# Altium schematic sheet Sheet1.SchDoc
size A4; SheetNumber: 1; SheetTotal: 1
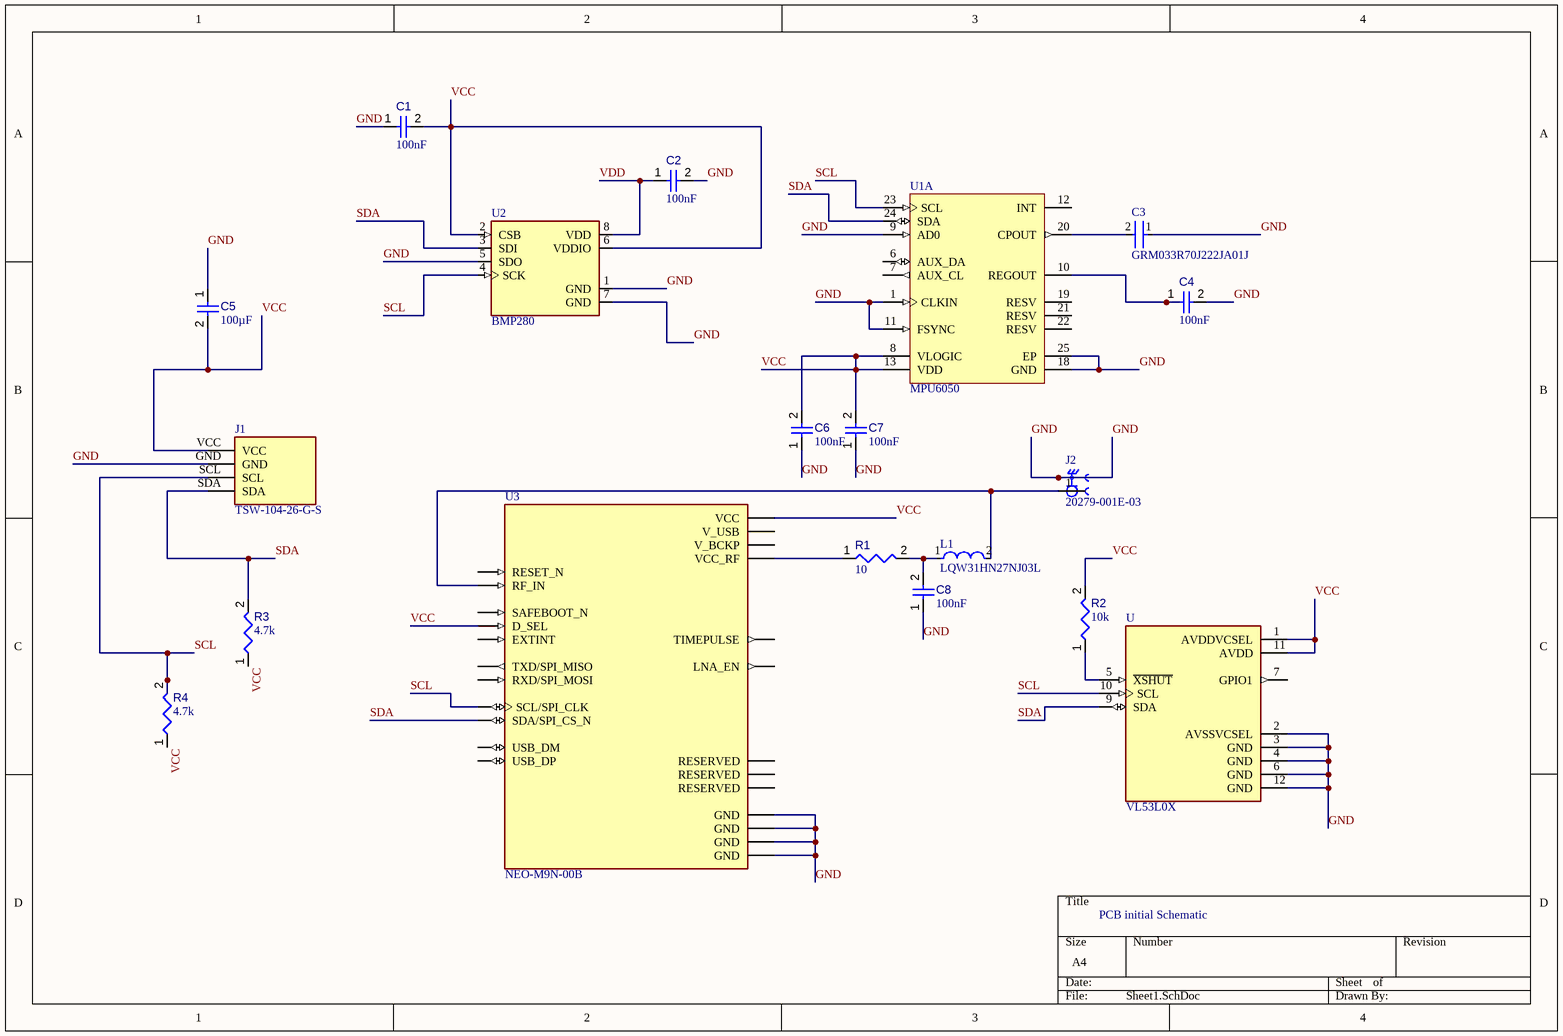
[diagram p0: Sheet1.SchDoc]

## Parts
C1  value 100nF  [CAPC0402(1005)60_L]  (hidden comment: Capacitor 100nF +/-20% 10V 0402)
C2  value 100nF  [CAPC0402(1005)60_L]  (hidden comment: Capacitor 100nF +/-20% 10V 0402)
C3  GRM033R70J222JA01J  [FP-GRM033-0_03-IPC_B]
C4  value 100nF  [CAPC1005X56X25LL10T15]  (hidden comment: Capacitor 0.1 uF +/- 5% 16 V 0402)
C5  value 100µF  [CAPC0805(2012)145_L]  (hidden comment: Capacitor 100µF +/-20% 6.3V 0805)
C6  value 100nF  [CAPC0402(1005)60_L]  (hidden comment: Capacitor 100nF +/-20% 10V 0402)
C7  value 100nF  [CAPC0402(1005)60_L]  (hidden comment: Capacitor 100nF +/-20% 10V 0402)
C8  value 100nF  [CAPC1608X90X40NL10T20]  (hidden comment: Capacitor 100 nF +/-10% 50 V 0603)
J1  TSW-104-26-G-S  [SAMTEC_TSW-104-26-G-S]
J2  20279-001E-03  [IPEX_20279-001E-03]
L1  LQW31HN27NJ03L  [FP-LQW31HN_03-MFG]
R1  value 10  [RESC0402(1005)_L]  (hidden comment: Resistor 10R  +/-1 % 0402 63 mW)
R2  value 10k  [RESC1005X40X25ML05T05]  (hidden comment: Resistor 10k +/-1% 0402 100 mW)
R3  value 4.7k  [RESC1005X40X25ML05T05]  (hidden comment: Resistor 4k7 +/-1% 0402 100 mW)
R4  value 4.7k  [RESC1005X40X25ML05T05]  (hidden comment: Resistor 4k7 +/-1% 0402 100 mW)
U  VL53L0X  [SENSOR_VL53L0X]
U1  MPU6050  [INSE-QFN-24_V]  (part A of 2)
U2  BMP280  [XDCR_BMP280]
U3  NEO-M9N-00B  [XCVR_NEO-M9N-00B]

## Nets
GND: C1.1 C2.2 C3.1 C4.2 C5.1 C6.1 C7.1 C8.1 J1.GND J2.2(GROUND) J2.3(GROUND) U.2(AVSSVCSEL) U.3(GND) U.4(GND) U.6(GND) U.12(GND) U1.1(CLKIN) U1.9(AD0) U1.11(FSYNC) U1.18(GND) U1.25(EP) U2.1(GND) U2.5(SDO) U2.7(GND) U3.10(GND) U3.12(GND) U3.13(GND) U3.24(GND)
SCL: J1.SCL R4.2 U.10(SCL) U1.23(SCL) U2.4(SCK) U3.19(SCL/SPI_CLK)
SDA: J1.SDA R3.2 U.9(SDA) U1.24(SDA) U2.3(SDI) U3.18(SDA/SPI_CS_N)
VCC: C1.2 C5.2 C6.2 C7.2 J1.VCC R2.2 R3.1 R4.1 U.1(AVDDVCSEL) U.11(AVDD) U1.8(VLOGIC) U1.13(VDD) U2.2(CSB) U2.6(VDDIO) U3.2(D_SEL) U3.23(VCC)
VDD: C2.1 U2.8(VDD)
NetC3_2: C3.2 U1.20(CPOUT)
NetC4_1: C4.1 U1.10(REGOUT)
NetC8_2: C8.2 L1.1 R1.2
NetJ2_1: J2.1(SIGNAL) L1.2 U3.11(RF_IN)
NetR1_1: R1.1 U3.9(VCC_RF)
NetR2_1: R2.1 U.5(~{XSHUT})

Not connected (* = marked no-connect by the designer): U 7(GPIO1); U1 6(AUX_DA) 7(AUX_CL) 12(INT) 19(RESV) 21(RESV) 22(RESV); U3 1(SAFEBOOT_N) 3(TIMEPULSE) 4(EXTINT) 5(USB_DM) 6(USB_DP) 7(V_USB) 8(RESET_N) 14(LNA_EN) 15(RESERVED) 16(RESERVED) 17(RESERVED) 20(TXD/SPI_MISO) 21(RXD/SPI_MOSI) 22(V_BCKP)

## Notes on the sheet
- PCB initial Schematic

## Library data of the parts
C1 C2 C6 C7 = CMP-001-00061-3: Chip Capacitor, 100nF +/-20%, 10V, 0402, Thickness 0.6 mm; Tolerance: 20%; Mounting Technology: SMT; Voltage Rating: 10V; Max Operating Temperature: 85°C; Pins: 2; Case/Package: 0402; Min Operating Temperature: -55°C
C3 = CMP-06035-025705-1: Chip Multilayer Ceramic Capacitors for General Purpose, 0201, 2200pF, X7R, 15%, 5%, 6.3V; Capacitance: 2.2nF; Voltage Rating (DC): 6.3V; Dielectric: X7R; Tolerance: 5%; Width: 300um; Thickness: 300um; Length: 600um
C4 = CMP-001-00001-6: Chip Capacitor, 0.1 uF, +/- 5%, 16 V, 0402 (1005 Metric); Capacitor Type: Ceramic; Voltage Rating: 16V; Max Operating Temperature: 125°C; Min Operating Temperature: -55°C; Case/Package: 0402; Mounting Technology: SM; Pins: 2; Tolerance: 5%; RoHS Compliant: True
C5 = CMP-001-00054-4: Chip Capacitor, 100µF +/-20%, 6.3V, 0805, Thickness 1.45 mm; Tolerance: 10%; Min Operating Temperature: -55°C; Max Operating Temperature: 85°C; Pins: 2; Mounting Technology: SMT; Case/Package: 0805; Voltage Rating: 6.3V
C8 = CMP-001-00017-6: Chip Capacitor, 100 nF, +/- 10%, 50 V, 0603 (1608 Metric); Voltage Rating: 50V; Capacitor Type: Ceramic; Tolerance: 10%; Mounting Technology: SM; Max Operating Temperature: 125°C; RoHS Compliant: True; Pins: 2; Case/Package: 0603; Min Operating Temperature: -55°C
J1 = CMP-009-000000-2: Component Type: Standard; Price: None; Availability: Unavailable; Value: *; Package: None; Pin Count: 4; MP: TSW-104-26-G-S; Source: TSW-104-26-G-S.SchLib; Design Item ID: TSW-104-26-G-S
J2 = CMP-002-00071-1: 1 POS Vertical SMD Small form factor with big performance through 6 GHz connector,MHF, RF, micro-coaxial MHF I Receptacle; MF: I-PEX; Value: *; Check_prices: https://www.snapeda.com/parts/20279-001E-03/I-PEX/view-part/?ref=eda; Component Type: Standard; Case/Package: None; MP: 20279-001E-03; Source: 20279-001E-03.SchLib; SnapEDA_Link: https://www.snapeda.com/parts/20279-001E-03/I-PEX/view-part/?ref=snap; Pins: 3; Design Item ID: 20279-001E-03
L1 = CMP-06042-006372-1: Wire Wound RF Inductor 27nH ±5% 0.0714Ω 560mA 1206; Self Resonant Frequency: 1GHz; Shielding: Unshielded; Core Material: Ferrite; Test Frequency: 100MHz; Q Factor: 60; DC Resistance (DCR): 51mR; Mount: Surface Mount; Inductance: 27nH; Max DC Current: 560mA; Military Standard: Not; Height: 1.8mm; Width: 0.063inch; Case Code (Metric): 3216; Height - Seated (Max): 0.079inch; Min Operating Temperature: -40°C; Weight: 0.000705oz; Package Quantity: 2000; Max Operating Temperature: 85°C; Current Rating: 560mA; Case Code (Imperial): 1206; Packaging: Tape and Reel; DC Current: 560mA; Termination: SMD/SMT; Depth: 1.8mm; Resistor Type: Wirewound; Radiation Hardening: No; Case/Package: 1206; Length: 3.2mm; Tolerance: 5%
R1 = CMP-009-00152-3: Chip Resistor, 10 Ohms, +/-1 %, 63 mW, -55 to 155 degC, 0402; Tolerance: 1%; Power: 63mW; Pins: 2; Max Operating Temperature: 155°C; Min Operating Temperature: -55°C; Case/Package: 0402
R2 = CMP-009-00015-5: Chip Resistor, 10 KOhm, +/- 1%, 0.1 W, -55 to 155 degC, 0402 (1005 Metric); Voltage Rating: 50V; Power: 100mW; Case/Package: 0402; RoHS Compliant: True; Min Operating Temperature: -55°C; Mounting Technology: SM; Tolerance: 1%; Max Operating Temperature: 155°C; Pins: 2
R3 R4 = CMP-009-00030-5: Chip Resistor, 4.7 KOhm, +/- 1%, 0.1 W, -55 to 155 degC, 0402 (1005 Metric); Power: 100mW; Voltage Rating: 50V; Mounting Technology: SM; RoHS Compliant: True; Tolerance: 1%; Min Operating Temperature: -55°C; Max Operating Temperature: 155°C; Case/Package: 0402; Pins: 2
U = CMP-013-000000-1: VL53L0X - Light, 3D Time-of-Flight _ToF_ Sensor Evaluation Board; MF: STMicroelectronics; Value: *; Pin Count: 11; MP: VL53L0X; Price: None; Availability: Unavailable; Source: SnapEDAsch.SchLib; Design Item ID: VL53L0X; SnapEDA_Link: https://www.snapeda.com/parts/VL53L0X/STMicroelectronics/view-part/473967/?ref=snap; Component Type: Standard; Package: None
U1 = CMP-010-00014-3: 3-Axis Gyroscope, 3-Axis Accelerometer, 2.375 to 3.46 V, -40 to 105 degC, 24-Pin QFN, RoHS, Tape and Reel; Manufacturer: InvenSense; Max Supply Voltage: 3.6V; Min Supply Voltage: 2.5V; Sensor Type: Motion; Interface: I2C; Min Operating Temperature: -40°C; Case/Package: QFN; Package Quantity: 5000; Pins: 24; RoHS Compliant: True; Packaging: CutTape; Datasheet URL: https://datasheet.ciiva.com/1513/1788002-1513632.pdf; Package Reference: QFN-24; Datasheet Version: Rev. 3.4, 08/2013; Package Description: 24-Pin Quad Flat No-lead Package, Body 4 x 4 mm, Pitch 0.5 mm; Max Operating Temperature: 85°C; Mounting Technology: SM
U2 = CMP-00029-00001-1: BMP280 Absolute Barometric Pressure Sensor for Battery Powered Devices 2 x 2.5mm; Value: *; Source: BMP280.SchLib; Price: None; Component Type: Standard; Availability: Unavailable; Case/Package: None; Pins: 8; MP: BMP280; Design Item ID: BMP280
U3 = CMP-015-000000-1: series RF Receiver BeiDou, Galileo, GLONASS, GNSS, GPS - -167dBm - - Module; MF: u-blox; SnapEDA_Link: https://www.snapeda.com/parts/NEO-M9N-00B/u-blox/view-part/?ref=snap; MP: NEO-M9N-00B; Source: NEO-M9N-00B.SchLib; Check_prices: https://www.snapeda.com/parts/NEO-M9N-00B/u-blox/view-part/?ref=eda; Value: *; Package: SMD-24 u-blox; Design Item ID: NEO-M9N-00B; Pin Count: 24; Component Type: Standard